# Altium project Senkron_Buck.PrjPcb (part 3 of 3)
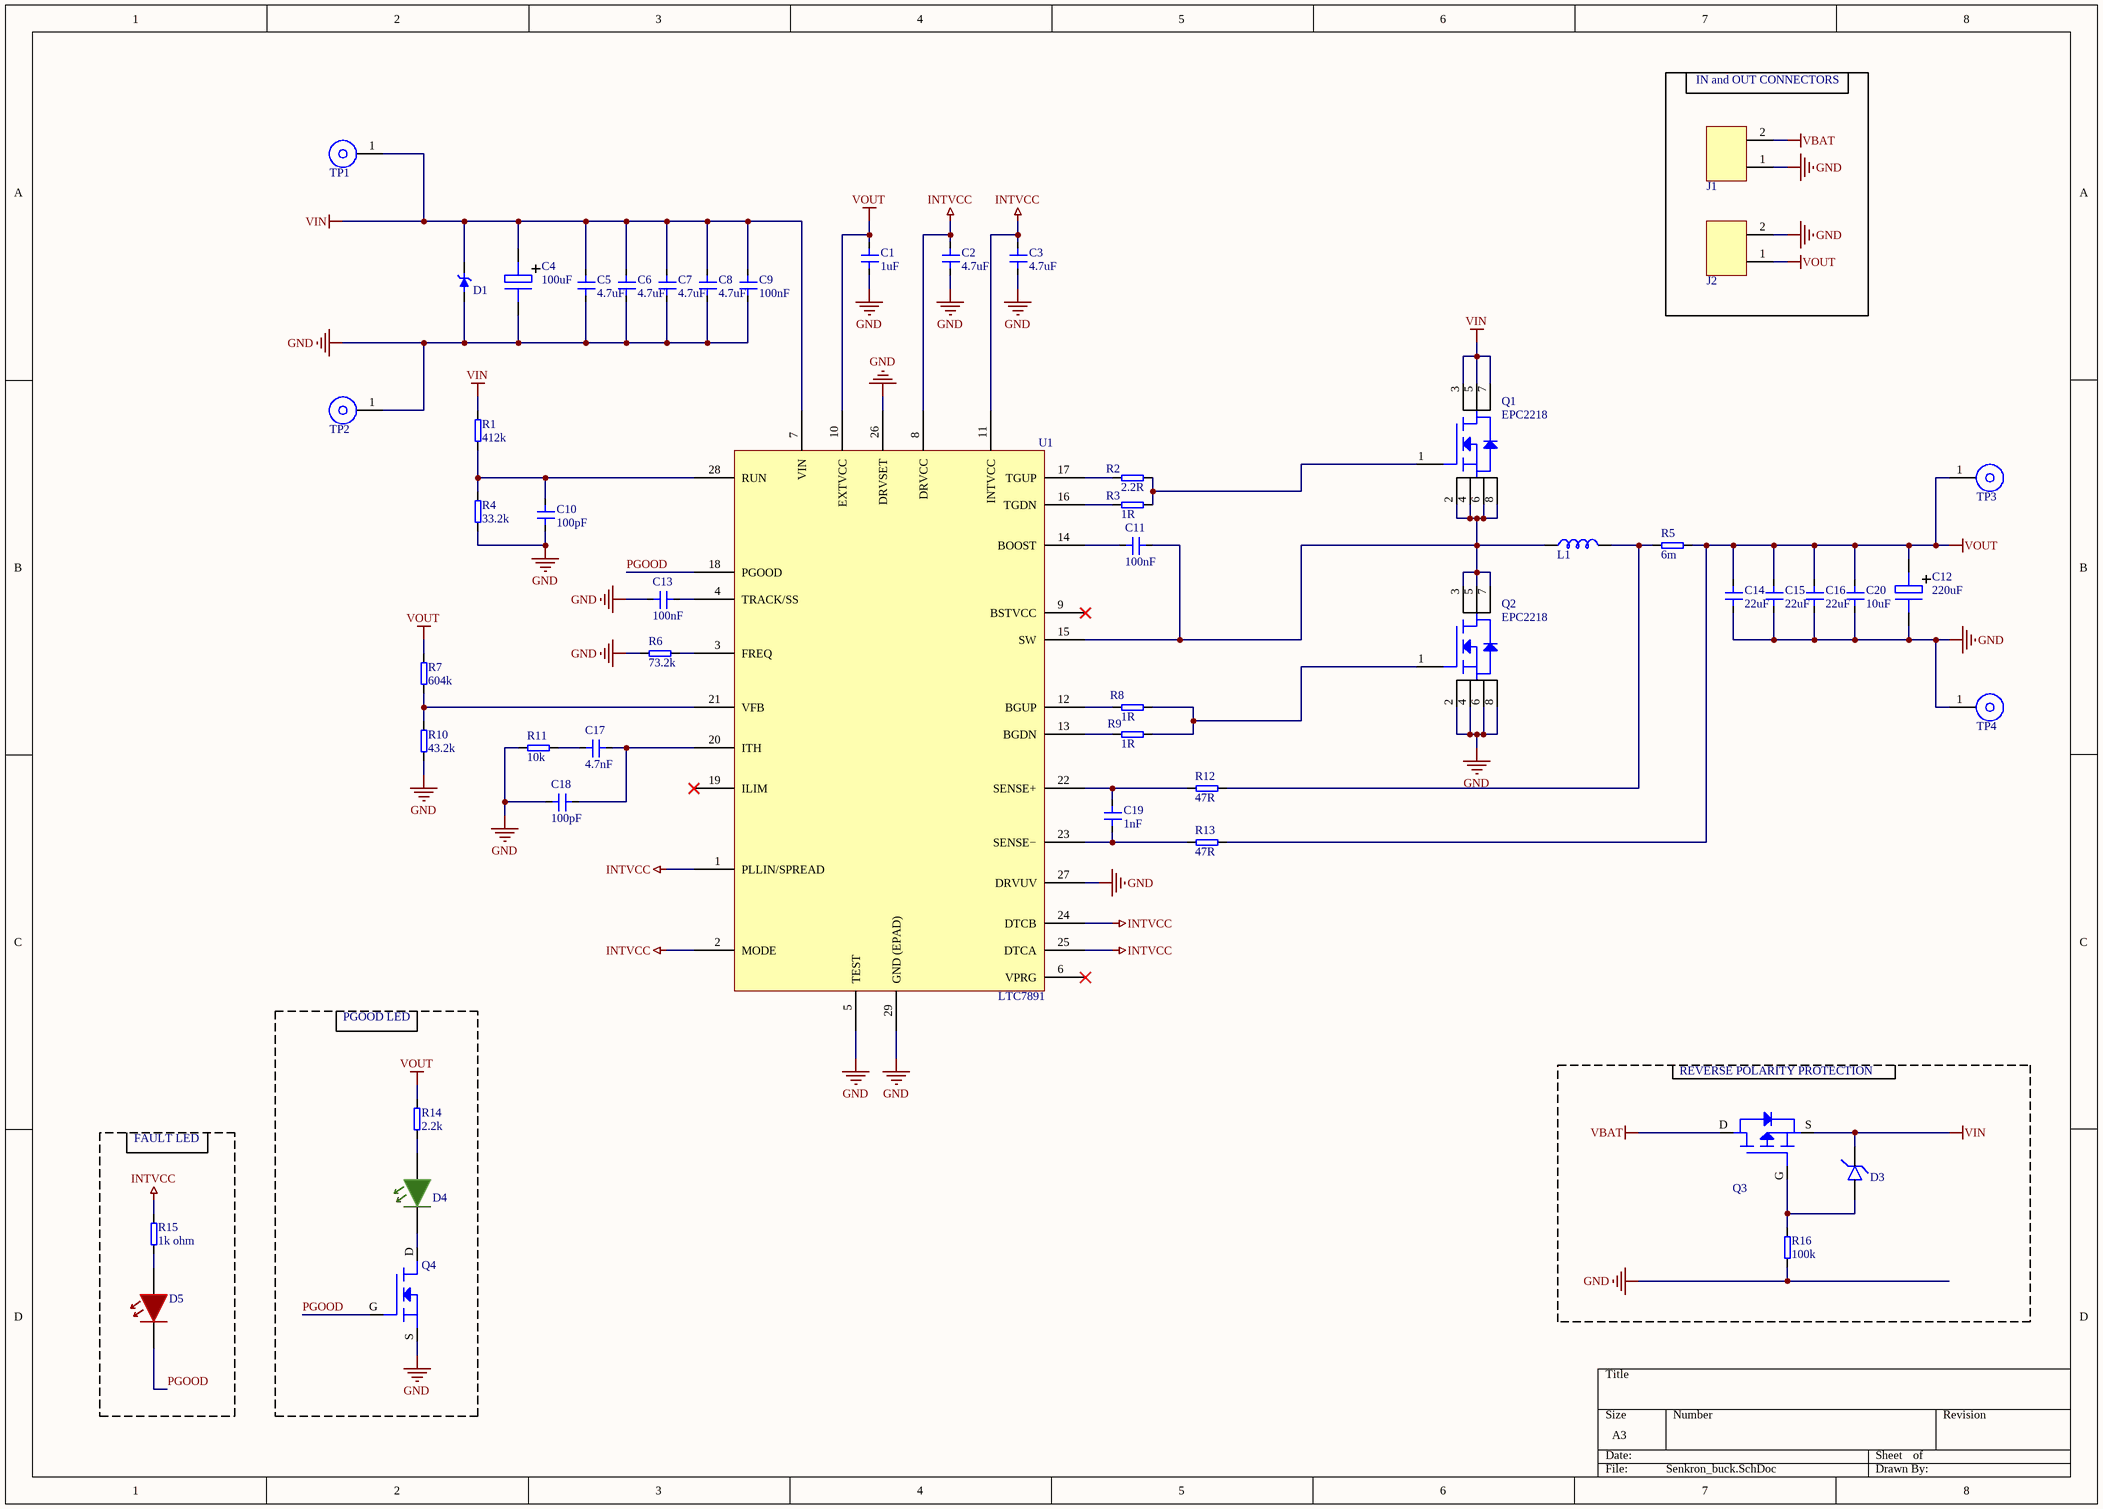
[diagram p2: Senkron_buck.SchDoc]

## Sheet Senkron_buck.SchDoc (continued)

### Library data of the parts (continued)
J1 J2 = 2P Screw Terminal Block: Barrier Strip Terminal Block, 13.5A, 1.5mm2, 1 Row(s), 1 Deck(s); Manufacturer: Phoenix Contact; Manufacturer Part Number: 1729128; Number of Decks: 1; Number of Ways: 2; Voltage Rating: 400V; Wire/Cable Gauge: 16AWG; Safety Approval: CSA,CUL,CB,EAC; ComponentLink1URL: https://datasheet.ciiva.com/16046/1729128-16046181.pdf?src-supplier=Onlinecomponents.com; ComponentLink1Description: https://datasheet.ciiva.com/16046/1729128-16046181.pdf?src-supplier=Onlinecomponents.com; ComponentLink2URL: https://datasheet.ciiva.com/15169/getdatasheetpartid-199310-15169845.pdf?src-supplier=Verical; ComponentLink2Description: https://datasheet.ciiva.com/15169/getdatasheetpartid-199310-15169845.pdf?src-supplier=Verical; ComponentLink3URL: https://datasheet.ciiva.com/823/1729128-823779.pdf?src-supplier=Digikey; ComponentLink3Description: https://datasheet.ciiva.com/823/1729128-823779.pdf?src-supplier=Digikey; ComponentLink4URL: https://datasheet.ciiva.com/14607/70054405-14607157.pdf?src-supplier=Allied+Electronics; ComponentLink4Description: https://datasheet.ciiva.com/14607/70054405-14607157.pdf?src-supplier=Allied+Electronics; ComponentLink5URL: https://datasheet.ciiva.com/29218/743664-da-01-en-printklemmenblock-mkdsn-1-5-2-5-08-29218154.pdf?src-supplier=Conrad; ComponentLink5Description: https://datasheet.ciiva.com/29218/743664-da-01-en-printklemmenblock-mkdsn-1-5-2-5-08-29218154.pdf?src-supplier=Conrad; ComponentLink6URL: https://datasheet.ciiva.com:443/pdfs/VipMasterIC/IC/ONST/ONST-S-A0002844216/ONST-S-A0002844216-1.pdf?src-supplier=IHS+Markit; ComponentLink6Description: https://datasheet.ciiva.com:443/pdfs/VipMasterIC/IC/ONST/ONST-S-A0002844216/ONST-S-A0002844216-1.pdf?src-supplier=IHS+Markit; ComponentLink7URL: https://datasheet.ciiva.com/825/osttcxx0162-825113.pdf?src-supplier=Digikey; ComponentLink7Description: https://datasheet.ciiva.com/825/osttcxx0162-825113.pdf?src-supplier=Digikey; ComponentLink8URL: https://datasheet.ciiva.com:443/pdfs/VipMasterIC/IC/PCON/PCON-S-A0008047989/PCON-S-A0008036843-1.pdf?src-supplier=IHS+Markit; ComponentLink8Description: https://datasheet.ciiva.com:443/pdfs/VipMasterIC/IC/PCON/PCON-S-A0008047989/PCON-S-A0008036843-1.pdf?src-supplier=IHS+Markit; Supplier: Digikey; Supplier Part Number: 277-1247-ND; RoHS: Yes; Category: Terminal Blocks; Stock: 25195; Pricing: 1=1,2, 10=1,104, 50=1,058, 100=1,012, 250=0,9844, 500=0,92, 1000=0,8464, 2500=0,782, 5000=0,7475 (USD); Mounting Technology: Board; Fastening Method: SCREW; Number of Rows: 1; Current Rating: 13.5A; Terminal and Terminal Block Type: BARRIER STRIP TERMINAL BLOCK; Wire Cross Section: 1.5mm2; RoHS Compliant: Yes; Reach SVHC Compliant: No
L1 = Inductor 10uH %20 SMD NONSTANDART 3.4mOhm: WE-HCI SMT Flat Wire High Current Inductor; Manufacturer: Wurth Elektronik; Manufacturer Part Number: 74435581000; DC Resistance (DCR): 3.4mΩ; Value: 10µH; Inductance Tolerance: 20%; Saturation Current: 8A; Self Resonant Frequency: 15MHz; ComponentLink1Description: Tedarikçi; ComponentLink1URL: https://www.e-komponent.com/10-uh-shielded-drum-core-wirewound-inductor-74435581000; Supplier: Mouser; Supplier Part Number: 710-74435581000; RoHS: Compliant; Category: Fixed Inductors; Stock: 497; Pricing: 1=7,34, 10=7,2, 50=6,37, 100=6,37, 1000=4,99, 10000=4,99 (USD); Ambient Temperature Range High: 75°C; Ambient Temperature Range Low: -40°C; Height: 12mm; Length: 22.5mm; Max Operating Temperature: 125°C; Min Operating Temperature: -40°C; Pins: 2; Width: 22mm; ComponentLink2URL: https://datasheet.octopart.com:443/74435581000-Wurth-Elektronik-datasheet-168489601.pdf?src-supplier=Wurth+Elektronik; ComponentLink2Description: https://datasheet.octopart.com:443/74435581000-Wurth-Elektronik-datasheet-168489601.pdf?src-supplier=Wurth+Elektronik; ComponentLink3URL: https://datasheet.octopart.com:443/74435581000-W%C3%BCrth-Elektronik-datasheet-141435431.pdf?src-supplier=Newark; ComponentLink3Description: https://datasheet.octopart.com:443/74435581000-W%C3%BCrth-Elektronik-datasheet-141435431.pdf?src-supplier=Newark; ComponentLink4URL: https://datasheet.octopart.com:443/74435581000-W%C3%BCrth-Elektronik-datasheet-12562517.pdf?src-supplier=Newark; ComponentLink4Description: https://datasheet.octopart.com:443/74435581000-W%C3%BCrth-Elektronik-datasheet-12562517.pdf?src-supplier=Newark; ComponentLink5URL: https://datasheet.octopart.com:443/74435581000-W%C3%BCrth-Elektronik-datasheet-112299786.pdf?src-supplier=Newark; ComponentLink5Description: https://datasheet.octopart.com:443/74435581000-W%C3%BCrth-Elektronik-datasheet-112299786.pdf?src-supplier=Newark
Q1 Q2 = EPC2218: N-Channel 100 V 60A (Ta) Surface Mount Die; Çalışma Sıcaklığı: -40°C ~ 150°C (TJ); Teknoloji: GaNFET (Gallium Nitride); Maksimum Açık Drain Source direnci - (Maks) @ Id, Vgs: 3.2mOhm @ 25A, 5V; Vgs(th) (Maks) @ Id: 2.5V @ 7mA; Maksimum Sürüş Gerilimi: 5V; Maksimum Gain Source Gerilimi: +6V, -4V; Drain Source Gerilimi (Vdss): 100 V; Maksimum Kapı Şarjı (Qg) @ Vgs: 16.3 nC @ 5 V; Maksimum Giriş Kapasitansı (Ciss) @ Vds: 2703 pF @ 50 V; Paket / Kılıf: Die; Montaj Tipi: Surface Mount; FET Tipi: N-Channel; Sürekli Drain Akımı (Id) @ 25°C: 60A (Ta); ComponentLink1Description: Tedarikçi; ComponentLink1URL: https://www.e-komponent.com/epc2218-epc-transistor-fet-mosfet-tekli; ComponentLink2Description: Datasheet; ComponentLink2URL: https://epc-co.com/epc/Portals/0/epc/documents/datasheets/EPC2218_datasheet.pdf?ver=C-R46UeqE-iEjg6gr7hUEg%3d%3d
Q3 = SQJ459EP-T1_GE3: SQJ459EP Series -60 V 0.024 Ohm Automotive P-Channel Mosfet - PowerPAK SO-8L; Manufacturer: Vishay; Continuous Drain Current (ID): 52A; Drain to Source Breakdown Voltage: -60V; Drain to Source Resistance: 18mΩ; Gate to Source Voltage (Vgs): 20V; Max Junction Temperature (Tj): 175°C; Number of Channels: 1; Power Dissipation: 83W; Turn-Off Delay Time: 88ns; Turn-On Delay Time: 12ns; Supplier: Mouser; Supplier Part Number: 78-SQJ459EP-T1_GE3; Manufacturer Part Number: SQJ459EP-T1_GE3; RoHS: Compliant; Category: MOSFETs; Stock: 10269; Pricing: 1=1,67, 10=1,26, 50=1,26, 100=0,864, 1000=0,633, 10000=0,526 (USD); Drain to Source Voltage (Vdss): -60V; Height: 1.267mm; Lifecycle Status: Production; Max Operating Temperature: 175°C; Min Breakdown Voltage: 60V; Min Operating Temperature: -55°C; Number of Elements: 1; Number of Terminals: 4; Schedule B: 8541290080, 8541290080|8541290080|8541290080|8541290080|8541290080; ComponentLink1URL: https://datasheet.octopart.com:443/SQJ459EP-T1_GE3-Vishay-datasheet-181474805.pdf?src-supplier=IHS; ComponentLink1Description: https://datasheet.octopart.com:443/SQJ459EP-T1_GE3-Vishay-datasheet-181474805.pdf?src-supplier=IHS; ComponentLink2URL: https://datasheet.octopart.com:443/SQJ459EP-T1_GE3-Vishay-datasheet-138899039.pdf?src-supplier=Upverter; ComponentLink2Description: https://datasheet.octopart.com:443/SQJ459EP-T1_GE3-Vishay-datasheet-138899039.pdf?src-supplier=Upverter; ComponentLink3URL: https://datasheet.octopart.com:443/SQJ459EP-T1_GE3-Vishay-datasheet-137754848.pdf?src-supplier=Future+Electronics; ComponentLink3Description: https://datasheet.octopart.com:443/SQJ459EP-T1_GE3-Vishay-datasheet-137754848.pdf?src-supplier=Future+Electronics; ComponentLink4URL: http://sigma.octopart.com:80/rohs_statement/Vishay-company-15.pdf?src-supplier=Compliance+Statements; ComponentLink4Description: http://sigma.octopart.com:80/rohs_statement/Vishay-company-15.pdf?src-supplier=Compliance+Statements
Q4 = PJA3416AE_R1_00001: MOSFET DIS.6.5A 20V N-CH SOT23 SMT; Manufacturer: Pan Jit; Designed by: Eren/Mehmet; Supplier: Mouser; Supplier Part Number: 241-PJA3416AER100001; Manufacturer Part Number: PJA3416AE_R1_00001; RoHS: No; Category: MOSFETs; Stock: 7147; Pricing: 1=0,29, 10=0,195, 50=0,195, 100=0,101, 1000=0,101, 10000=0,062 (USD); ComponentLink1Description: Datasheet; ComponentLink1URL: https://cdn.ozdisan.com/ETicaret_Dosya/601491_131509.pdf; ComponentLink2Description: Supplier; ComponentLink2URL: https://ozdisan.com/guc-yari-iletkenleri/mosfetler/discrete-mosfetler/PJA3416AER100001/601492
R1 = RES 412k Ohm %1 SMD 0805: RES.(2012) 0805 412K Ohms 1% 1/8W-S 100PPM; Manufacturer: Royal Ohm; Manufacturer Part Number: 0805S8F4123T5E; Supplier: Mouser; Supplier Part Number: 303-0805S8F4123T5E; Category: Uncategorized; Pricing: 10000=0,001 (USD); ComponentLink1Description: Tedarikçi; ComponentLink1URL: https://www.ozdisan.com/p/smt-smd-ve-cip-direncler-194/royalohm-0805s8f4123t5e-505640
R2 = RES 2.2R Ohm %1 SMD 0603_1: RES.(1608) 0603 2.2 Ohms 1% 1/10W AUTOMOTIV; Manufacturer: Royal Ohm; Manufacturer Part Number: CQ03SAF220KT5E; Value: 2.2Ω; Supplier: Mouser; Supplier Part Number: 303-CQ03SAF220KT5E; Category: Uncategorized; Pricing: 10000=0,002 (USD); ComponentLink1Description: Tedarikçi; ComponentLink1URL: https://www.ozdisan.com/p/smt-smd-ve-cip-direncler-194/royalohm-cq03saf220kt5e-587939
R3 R8 R9 = RES 1R Ohm %1 SMD 0603: RES.(1608) 0603 1 Ohms 1% 1/10W AUTOMOTIV; Manufacturer: Royal Ohm; Manufacturer Part Number: CQ03SAF100KT5E; Value: 1Ω; Supplier: Mouser; Supplier Part Number: 303-CQ03SAF100KT5E; Category: Uncategorized; Pricing: 10000=0,002 (USD); ComponentLink1Description: Tedarikçi; ComponentLink1URL: https://www.ozdisan.com/p/smt-smd-ve-cip-direncler-194/royalohm-cq03saf100kt5e-587589
R4 = RES 33.2k Ohm %1 SMD 0805: RES.(2012) 0805 33.2K Ohms 1% 1/8W-S 100PPM; Manufacturer: Royal Ohm; Manufacturer Part Number: 0805S8F3322T5E; Value: 33.2kΩ; Temperature Coefficient: 100ppm/°C; Supplier: Mouser; Supplier Part Number: 303-0805S8F3322T5E; Category: Uncategorized; Pricing: 10000=0,001 (USD); ComponentLink1URL: https://datasheet.octopart.com:443/0805S8F3322T5E-Royal-Ohm-datasheet-165785611.pdf?src-supplier=TME; ComponentLink1Description: https://datasheet.octopart.com:443/0805S8F3322T5E-Royal-Ohm-datasheet-165785611.pdf?src-supplier=TME; ComponentLink2URL: https://datasheet.octopart.com:443/0805S8F3322T5E-Royal-Ohm-datasheet-157855877.pdf?src-supplier=TME; ComponentLink2Description: https://datasheet.octopart.com:443/0805S8F3322T5E-Royal-Ohm-datasheet-157855877.pdf?src-supplier=TME; ComponentLink3URL: https://datasheet.octopart.com:443/0805S8F3322T5E-Royal-Ohm-datasheet-62069544.pdf?src-supplier=TME; ComponentLink3Description: https://datasheet.octopart.com:443/0805S8F3322T5E-Royal-Ohm-datasheet-62069544.pdf?src-supplier=TME; ComponentLink4Description: Tedarikçi; ComponentLink4URL: https://www.ozdisan.com/p/smt-smd-ve-cip-direncler-194/royalohm-0805s8f3322t5e-505560
R5 = RES 6m Ohm %1 SMD 1206: RES.(3216) 1206 6m Ohms 1% 1W 50PPM; Üretici Ürün Kodu: ML061WF600NT5E; Kılıf / Kasa: 1206 (3216 Metric); Direnç Değeri: 6 m Ohms; ComponentLink1Description: Tedarikçi; ComponentLink1URL: https://www.ozdisan.com/p/smt-smd-ve-cip-direncler-194/royalohm-ml061wf600nt5e-740932; Tolerans: ±1 %; Güç: 1W
R6 = RES 73.2k Ohm %1 SMD 0603: RES.(1608) 0603 73.2K Ohms 1% 1/10W-S 100PPM; Manufacturer: Royal Ohm; Manufacturer Part Number: 0603SAF7322T5E; Supplier: Mouser; Supplier Part Number: 303-0603SAF7322T5E; Category: Uncategorized; Pricing: 10000=0,001 (USD); ComponentLink1Description: Tedarikçi; ComponentLink1URL: https://www.ozdisan.com/p/smt-smd-ve-cip-direncler-194/royalohm-0603saf7322t5e-505956
R7 = RES 604k Ohm %1 SMD 0805: RES.(2012) 0805 604K Ohms 1% 1/8W-S 100PPM; Manufacturer: Royal Ohm; Manufacturer Part Number: 0805S8F6043T5E; Supplier: Mouser; Supplier Part Number: 303-0805S8F6043T5E; Category: Uncategorized; Pricing: 10000=0,001 (USD); ComponentLink1Description: Tedarikçi; ComponentLink1URL: https://www.ozdisan.com/p/smt-smd-ve-cip-direncler-194/royalohm-0805s8f6043t5e-505655
R10 = RES 43.2k Ohm %1 SMD 0805: RES.(2012) 0805 43.2K Ohms 1% 1/8W-S 100PPM; Manufacturer: Royal Ohm; Manufacturer Part Number: 0805S8F4322T5E; Value: 43.2kΩ; Temperature Coefficient: 100ppm/°C; Supplier: Mouser; Supplier Part Number: 303-0805S8F4322T5E; Category: Uncategorized; Pricing: 10000=0,001 (USD); ComponentLink1URL: https://datasheet.octopart.com:443/0805S8F4322T5E-Royal-Ohm-datasheet-165785611.pdf?src-supplier=TME; ComponentLink1Description: https://datasheet.octopart.com:443/0805S8F4322T5E-Royal-Ohm-datasheet-165785611.pdf?src-supplier=TME; ComponentLink2URL: https://datasheet.octopart.com:443/0805S8F4322T5E-Royal-Ohm-datasheet-157855877.pdf?src-supplier=TME; ComponentLink2Description: https://datasheet.octopart.com:443/0805S8F4322T5E-Royal-Ohm-datasheet-157855877.pdf?src-supplier=TME; ComponentLink3URL: https://datasheet.octopart.com:443/0805S8F4322T5E-Royal-Ohm-datasheet-62069544.pdf?src-supplier=TME; ComponentLink3Description: https://datasheet.octopart.com:443/0805S8F4322T5E-Royal-Ohm-datasheet-62069544.pdf?src-supplier=TME; ComponentLink4Description: Tedarikçi; ComponentLink4URL: https://www.ozdisan.com/p/smt-smd-ve-cip-direncler-194/royalohm-0805s8f4322t5e-505567
R11 = RES 10kOhm %1 SMD 0603: 100mW Thick Film Resistors ±100ppm/℃ ±1% 10kΩ 0603 Chip Resistor - Surface Mount ROHS; Manufacturer: Yageo Group; Manufacturer Part Number: RC0603FR-0710KL; Temperature Coefficient: 100ppm/°C; Voltage Rating: 75V; Voltage Rating (DC): 50V; Supplier: Mouser; Supplier Part Number: 603-RC0603FR-0710KL; RoHS: Compliant; Category: Chip SMD Resistors; Stock: 6497070; Pricing: 1=0,1, 10=0,006, 50=0,006, 100=0,006, 1000=0,006, 10000=0,002 (USD); Case/Package: 0603; Case Code (Imperial): 0603; Case Code (Metric): 0603; China RoHS: Non-Compliant; Composition: Thick Film; Depth: 800µm; Height: 450µm; Lead Free: Lead Free; Lead Pitch: 300µm; Length: 1.6mm; Lifecycle Status: Production; Max Operating Temperature: 155°C; Military Standard: Not; Min Operating Temperature: -55°C; Mounting Technology: Surface Mount; Pins: 2; Number of Terminals: 2; Packaging: Tape & Reel; Power Dissipation: 100mW; Power Rating: 100mW; REACH SVHC: Yes; Value: 10kΩ; Schedule B: 8533210045, 8533210045|8533210045|8533210045|8533210045|8533210045|8533210045|8533210045|8533210045|8533210045|8533210045|8533210045|8533210045|8533210045|8533210045|8533210045|8533210045|8533210045|8533210045|8533210045|8533210045|8533210045|8533210045|8533210045|85; Termination: SMD/SMT; Tolerance: 1%; Weight: 2.012816mg; Width: 800µm; Working Voltage: 75V; ComponentLink1URL: https://datasheet.octopart.com:443/RC0603FR-0710KL-Yageo-datasheet-175887523.pdf?src-supplier=IHS; ComponentLink1Description: https://datasheet.octopart.com:443/RC0603FR-0710KL-Yageo-datasheet-175887523.pdf?src-supplier=IHS; ComponentLink2URL: https://datasheet.octopart.com:443/RC0603FR-0710KL-Yageo-datasheet-103092701.pdf?src-supplier=Upverter; ComponentLink2Description: https://datasheet.octopart.com:443/RC0603FR-0710KL-Yageo-datasheet-103092701.pdf?src-supplier=Upverter; ComponentLink3URL: https://datasheet.octopart.com:443/RC0603FR-0710KL-Yageo-datasheet-98239111.pdf?src-supplier=Upverter; ComponentLink3Description: https://datasheet.octopart.com:443/RC0603FR-0710KL-Yageo-datasheet-98239111.pdf?src-supplier=Upverter; ComponentLink4URL: https://datasheet.octopart.com:443/RC0603FR-0710KL-Yageo-datasheet-141265859.pdf?src-supplier=Upverter; ComponentLink4Description: https://datasheet.octopart.com:443/RC0603FR-0710KL-Yageo-datasheet-141265859.pdf?src-supplier=Upverter; ComponentLink5URL: https://sigma.octopart.com:443/138820526/technical_drawing/Yageo-RC0603FR-0710KL.pdf?src-supplier=Upverter; ComponentLink5Description: https://sigma.octopart.com:443/138820526/technical_drawing/Yageo-RC0603FR-0710KL.pdf?src-supplier=Upverter; ComponentLink6URL: https://datasheet.octopart.com:443/RC0603FR-0710KL-Yageo-datasheet-8328172.pdf?src-supplier=Farnell; ComponentLink6Description: https://datasheet.octopart.com:443/RC0603FR-0710KL-Yageo-datasheet-8328172.pdf?src-supplier=Farnell; ComponentLink7URL: https://datasheet.octopart.com:443/RC0603FR-0710KL-Yageo-datasheet-13691069.pdf?src-supplier=Farnell; ComponentLink7Description: https://datasheet.octopart.com:443/RC0603FR-0710KL-Yageo-datasheet-13691069.pdf?src-supplier=Farnell; ComponentLink8URL: https://datasheet.octopart.com:443/RC0603FR-0710KL-Yageo-datasheet-62067350.pdf?src-supplier=element14+APAC; ComponentLink8Description: https://datasheet.octopart.com:443/RC0603FR-0710KL-Yageo-datasheet-62067350.pdf?src-supplier=element14+APAC; ComponentLink9URL: https://datasheet.octopart.com:443/RC0603FR-0710KL-Yageo-datasheet-17842380.pdf?src-supplier=element14+APAC; ComponentLink9Description: https://datasheet.octopart.com:443/RC0603FR-0710KL-Yageo-datasheet-17842380.pdf?src-supplier=element14+APAC; ComponentLink10URL: https://datasheet.octopart.com:443/RC0603FR-0710KL-Yageo-datasheet-15599030.pdf?src-supplier=Future+Electronics; ComponentLink10Description: https://datasheet.octopart.com:443/RC0603FR-0710KL-Yageo-datasheet-15599030.pdf?src-supplier=Future+Electronics; ComponentLink11URL: https://datasheet.octopart.com:443/RC0603FR-0710KL-Yageo-datasheet-164759695.pdf?src-supplier=Future+Electronics; ComponentLink11Description: https://datasheet.octopart.com:443/RC0603FR-0710KL-Yageo-datasheet-164759695.pdf?src-supplier=Future+Electronics; ComponentLink12URL: https://datasheet.octopart.com:443/RC0603FR-0710KL-Yageo-datasheet-127823281.pdf?src-supplier=Future+Electronics; ComponentLink12Description: https://datasheet.octopart.com:443/RC0603FR-0710KL-Yageo-datasheet-127823281.pdf?src-supplier=Future+Electronics; ComponentLink13URL: https://datasheet.octopart.com:443/RC0603FR-0710KL-Yageo-datasheet-137700087.pdf?src-supplier=Future+Electronics; ComponentLink13Description: https://datasheet.octopart.com:443/RC0603FR-0710KL-Yageo-datasheet-137700087.pdf?src-supplier=Future+Electronics; ComponentLink14URL: https://datasheet.octopart.com:443/RC0603FR-0710KL-Yageo-datasheet-27584510.pdf?src-supplier=Future+Electronics; ComponentLink14Description: https://datasheet.octopart.com:443/RC0603FR-0710KL-Yageo-datasheet-27584510.pdf?src-supplier=Future+Electronics; ComponentLink15URL: https://datasheet.octopart.com:443/RC0603FR-0710KL-Yageo-datasheet-8324193.pdf?src-supplier=Future+Electronics; ComponentLink15Description: https://datasheet.octopart.com:443/RC0603FR-0710KL-Yageo-datasheet-8324193.pdf?src-supplier=Future+Electronics; ComponentLink16URL: https://datasheet.octopart.com:443/RC0603FR-0710KL-Yageo-datasheet-12596169.pdf?src-supplier=Newark; ComponentLink16Description: https://datasheet.octopart.com:443/RC0603FR-0710KL-Yageo-datasheet-12596169.pdf?src-supplier=Newark; ComponentLink17URL: https://datasheet.octopart.com:443/RC0603FR-0710KL-Yageo-datasheet-503470.pdf?src-supplier=Newark; ComponentLink17Description: https://datasheet.octopart.com:443/RC0603FR-0710KL-Yageo-datasheet-503470.pdf?src-supplier=Newark; ComponentLink18URL: https://datasheet.octopart.com:443/RC0603FR-0710KL-Yageo-datasheet-34211833.pdf?src-supplier=Newark; ComponentLink18Description: https://datasheet.octopart.com:443/RC0603FR-0710KL-Yageo-datasheet-34211833.pdf?src-supplier=Newark; ComponentLink19URL: https://datasheet.octopart.com:443/RC0603FR-0710KL-Yageo-datasheet-79472498.pdf?src-supplier=Megastar; ComponentLink19Description: https://datasheet.octopart.com:443/RC0603FR-0710KL-Yageo-datasheet-79472498.pdf?src-supplier=Megastar; ComponentLink20URL: https://datasheet.octopart.com/RC0603FR-0710KL-Yageo-datasheet-73766026.pdf; ComponentLink20Description: https://datasheet.octopart.com/RC0603FR-0710KL-Yageo-datasheet-73766026.pdf; ComponentLink21URL: https://datasheet.octopart.com:443/RC0603FR-0710KL-Yageo-datasheet-118562.pdf?src-supplier=DigiKey; ComponentLink21Description: https://datasheet.octopart.com:443/RC0603FR-0710KL-Yageo-datasheet-118562.pdf?src-supplier=DigiKey; ComponentLink22URL: http://sigma.octopart.com:80/rohs_statement/Yageo-company-2.pdf?src-supplier=Compliance+Statements; ComponentLink22Description: http://sigma.octopart.com:80/rohs_statement/Yageo-company-2.pdf?src-supplier=Compliance+Statements; ComponentLink23URL: http://sigma.octopart.com:80/conflict_mineral_statement/Yageo-company-3.pdf?src-supplier=Compliance+Statements; ComponentLink23Description: http://sigma.octopart.com:80/conflict_mineral_statement/Yageo-company-3.pdf?src-supplier=Compliance+Statements; ComponentLink24Description: Tedarikçi; ComponentLink24URL: https://www.ozdisan.com/p/smt-smd-ve-cip-direncler-194/yageo-rc0603fr-0710kl-379294
R12 R13 = RES 47R Ohm %1 SMD 0603: RES.(1608) 0603 47 Ohms 1% 1/10W AUTOMOTIV; Manufacturer: Royal Ohm; Manufacturer Part Number: CQ03SAF470JT5E; Value: 47Ω; Supplier: Mouser; Supplier Part Number: 303-CQ03SAF470JT5E; Category: Uncategorized; Pricing: 10000=0,001 (USD); ComponentLink1URL: https://datasheet.octopart.com:443/CQ03SAF470JT5E-Royal-Ohm-datasheet-159080023.pdf?src-supplier=TME; ComponentLink1Description: https://datasheet.octopart.com:443/CQ03SAF470JT5E-Royal-Ohm-datasheet-159080023.pdf?src-supplier=TME; ComponentLink2URL: https://datasheet.octopart.com:443/CQ03SAF470JT5E-Royal-Ohm-datasheet-140586692.pdf?src-supplier=TME; ComponentLink2Description: https://datasheet.octopart.com:443/CQ03SAF470JT5E-Royal-Ohm-datasheet-140586692.pdf?src-supplier=TME; ComponentLink3Description: Tedarikçi; ComponentLink3URL: https://www.ozdisan.com/p/smt-smd-ve-cip-direncler-194/royalohm-cq03saf470jt5e-587944
R14 = RES 2.2k Ohm %1 SMD 0603: Res Thick Film 0603 2.2K Ohm 1% 0.1W(1/10W) +/-100ppm/C Epoxy Pad SMD T/R; Manufacturer: Yageo Group; Manufacturer Part Number: RC0603FR-072K2L; Max Power Dissipation: 100mW; Value: 2.2kΩ; Temperature Coefficient: 100ppm/°C; Voltage Rating: 75V; Voltage Rating (DC): 50V; Supplier: Mouser; Supplier Part Number: 603-RC0603FR-072K2L; RoHS: Compliant; Category: Chip SMD Resistors; Stock: 1388232; Pricing: 1=0,1, 10=0,007, 50=0,007, 100=0,006, 1000=0,006, 10000=0,002 (USD); Case/Package: 0603; Case Code (Imperial): 0603; Case Code (Metric): 0603; China RoHS: Non-Compliant; Composition: Thick Film; Depth: 800µm; Features: Moisture Resistant; Height: 450µm; Lead Free: Lead Free; Length: 1.6mm; Lifecycle Status: Production; Max Operating Temperature: 155°C; Military Standard: Not; Min Operating Temperature: -55°C; Mounting Technology: Surface Mount; Pins: 2; Number of Terminals: 2; Number of Terminations: 2; Packaging: Tape & Reel; Power Dissipation: 100mW; Power Rating: 100mW; REACH SVHC: Yes; Schedule B: 8533210045, 8533210045|8533210045|8533210045|8533210045|8533210045|8533210045|8533210045|8533210045|8533210045|8533210045|8533210045|8533210045|8533210045|8533210045|8533210045, 8533210045|8533210045|8533210045|8533210045|8533210045|8533210045|8533210045|8533210045|8533210045|8533210045|8533210045|8533210045|8533210045|8533210045|8533210045|8533210045, 8533210045|8533210045|8533210045|8533210045|8533210045|8533210045|8533210045|8533210045|8533210045|8533210045|8533210045|8533210045|8533210045|8533210045|8533210045|8533210045|8533210045; Termination: SMD/SMT; Tolerance: 1%; Width: 800µm; Working Voltage: 75V; ComponentLink1URL: https://datasheet.octopart.com:443/RC0603FR-072K2L-Yageo-datasheet-175887523.pdf?src-supplier=IHS; ComponentLink1Description: https://datasheet.octopart.com:443/RC0603FR-072K2L-Yageo-datasheet-175887523.pdf?src-supplier=IHS; ComponentLink2URL: https://datasheet.octopart.com:443/RC0603FR-072K2L-Yageo-datasheet-103092701.pdf?src-supplier=Upverter; ComponentLink2Description: https://datasheet.octopart.com:443/RC0603FR-072K2L-Yageo-datasheet-103092701.pdf?src-supplier=Upverter; ComponentLink3URL: https://datasheet.octopart.com:443/RC0603FR-072K2L-Yageo-datasheet-8328172.pdf?src-supplier=Newark; ComponentLink3Description: https://datasheet.octopart.com:443/RC0603FR-072K2L-Yageo-datasheet-8328172.pdf?src-supplier=Newark; ComponentLink4URL: https://datasheet.octopart.com:443/RC0603FR-072K2L-Yageo-datasheet-12596169.pdf?src-supplier=Newark; ComponentLink4Description: https://datasheet.octopart.com:443/RC0603FR-072K2L-Yageo-datasheet-12596169.pdf?src-supplier=Newark; ComponentLink5URL: https://datasheet.octopart.com:443/RC0603FR-072K2L-Yageo-datasheet-13691069.pdf?src-supplier=Newark; ComponentLink5Description: https://datasheet.octopart.com:443/RC0603FR-072K2L-Yageo-datasheet-13691069.pdf?src-supplier=Newark; ComponentLink6URL: https://datasheet.octopart.com:443/RC0603FR-072K2L-Yageo-datasheet-34211833.pdf?src-supplier=element14+APAC; ComponentLink6Description: https://datasheet.octopart.com:443/RC0603FR-072K2L-Yageo-datasheet-34211833.pdf?src-supplier=element14+APAC; ComponentLink7URL: https://datasheet.octopart.com:443/RC0603FR-072K2L-Yageo-datasheet-62067350.pdf?src-supplier=element14+APAC; ComponentLink7Description: https://datasheet.octopart.com:443/RC0603FR-072K2L-Yageo-datasheet-62067350.pdf?src-supplier=element14+APAC; ComponentLink8URL: https://datasheet.octopart.com:443/RC0603FR-072K2L-Yageo-datasheet-17842380.pdf?src-supplier=element14+APAC; ComponentLink8Description: https://datasheet.octopart.com:443/RC0603FR-072K2L-Yageo-datasheet-17842380.pdf?src-supplier=element14+APAC; ComponentLink9URL: https://datasheet.octopart.com:443/RC0603FR-072K2L-Yageo-datasheet-21426514.pdf?src-supplier=element14+APAC; ComponentLink9Description: https://datasheet.octopart.com:443/RC0603FR-072K2L-Yageo-datasheet-21426514.pdf?src-supplier=element14+APAC; ComponentLink10URL: https://datasheet.octopart.com:443/RC0603FR-072K2L-Yageo-datasheet-164759695.pdf?src-supplier=Future+Electronics; ComponentLink10Description: https://datasheet.octopart.com:443/RC0603FR-072K2L-Yageo-datasheet-164759695.pdf?src-supplier=Future+Electronics; ComponentLink11URL: https://datasheet.octopart.com:443/RC0603FR-072K2L-Yageo-datasheet-137700087.pdf?src-supplier=Future+Electronics; ComponentLink11Description: https://datasheet.octopart.com:443/RC0603FR-072K2L-Yageo-datasheet-137700087.pdf?src-supplier=Future+Electronics; ComponentLink12URL: https://datasheet.octopart.com:443/RC0603FR-072K2L-Yageo-datasheet-27584510.pdf?src-supplier=Future+Electronics; ComponentLink12Description: https://datasheet.octopart.com:443/RC0603FR-072K2L-Yageo-datasheet-27584510.pdf?src-supplier=Future+Electronics; ComponentLink13URL: https://datasheet.octopart.com:443/RC0603FR-072K2L-Yageo-datasheet-15599030.pdf?src-supplier=Future+Electronics; ComponentLink13Description: https://datasheet.octopart.com:443/RC0603FR-072K2L-Yageo-datasheet-15599030.pdf?src-supplier=Future+Electronics; ComponentLink14URL: https://datasheet.octopart.com:443/RC0603FR-072K2L-Yageo-datasheet-8324193.pdf?src-supplier=Future+Electronics; ComponentLink14Description: https://datasheet.octopart.com:443/RC0603FR-072K2L-Yageo-datasheet-8324193.pdf?src-supplier=Future+Electronics; ComponentLink15URL: https://datasheet.octopart.com:443/RC0603FR-072K2L-Yageo-datasheet-79472498.pdf?src-supplier=Megastar; ComponentLink15Description: https://datasheet.octopart.com:443/RC0603FR-072K2L-Yageo-datasheet-79472498.pdf?src-supplier=Megastar; ComponentLink16URL: https://datasheet.octopart.com/RC0603FR-072K2L-Yageo-datasheet-73766026.pdf; ComponentLink16Description: https://datasheet.octopart.com/RC0603FR-072K2L-Yageo-datasheet-73766026.pdf; ComponentLink17URL: https://datasheet.octopart.com:443/RC0603FR-072K2L-Yageo-datasheet-118562.pdf?src-supplier=DigiKey; ComponentLink17Description: https://datasheet.octopart.com:443/RC0603FR-072K2L-Yageo-datasheet-118562.pdf?src-supplier=DigiKey; ComponentLink18URL: https://datasheet.octopart.com:443/RC0603FR-072K2L-Yageo-datasheet-499455.pdf?src-supplier=element14; ComponentLink18Description: https://datasheet.octopart.com:443/RC0603FR-072K2L-Yageo-datasheet-499455.pdf?src-supplier=element14; ComponentLink19URL: http://sigma.octopart.com:80/conflict_mineral_statement/Yageo-company-3.pdf?src-supplier=Compliance+Statements; ComponentLink19Description: http://sigma.octopart.com:80/conflict_mineral_statement/Yageo-company-3.pdf?src-supplier=Compliance+Statements; ComponentLink20URL: http://sigma.octopart.com:80/rohs_statement/Yageo-company-2.pdf?src-supplier=Compliance+Statements; ComponentLink20Description: http://sigma.octopart.com:80/rohs_statement/Yageo-company-2.pdf?src-supplier=Compliance+Statements
R15 = RES 1kOhm %5 SMD 0603: (RC0603JR-071KL) SMD Chip Resistor, 1 kOhm, ï¿½ 5%, 100 mW, 0603 [1608 Metric], Thick Film, General Purpose; Manufacturer: Yageo; Value: 1kR; Temperature Coefficient: 100ppm/°C; Voltage Rating (DC): 50V; Power Rating: 100mW; Body Length: 1.6mm; Designed by: Eren/Mehmet; Supplier: Mouser; Supplier Part Number: 603-RC0603JR-071KL; Manufacturer Part Number: RC0603JR-071KL; RoHS: Yes; Category: Chip SMD Resistors; Stock: 1707256; Pricing: 1=0,1, 10=0,01, 50=0,01, 100=0,006, 1000=0,005, 10000=0,002 (USD); Case/Package: 0603; Pins: 2; Contact Plating: Tin,Matte; Case Code (Imperial): 0603; Case Code (Metric): 1608; Min Operating Temperature: -55°C; Max Operating Temperature: 155°C; Tolerance: 5%; Resistor Type: Thick Film; Packaging: Tape and Reel; Package Quantity: 5000; Voltage Rating: 50V; Termination: SMD/SMT; Series: RC; Resistance Tolerance: 5%; Construction: Rectangular; Max Power Dissipation: 100mW; Number of Terminations: 2; Voltage Rating (AC): 50V; Length: 1.6mm; Width: 0.8mm; Height: 0.45mm; Depth: 0.8mm; Reach SVHC Compliant: No; Lead Free: 5697LeadFree; Military Standard: Not; RoHS Compliant: Yes; ComponentLink1Description: https://ozdisan.com/pasif-komponentler/direncler/smt-smd-ve-cip-direncler/RC0603JR-071KL/534826; ComponentLink1URL: https://ozdisan.com/pasif-komponentler/direncler/smt-smd-ve-cip-direncler/RC0603JR-071KL/534826
R16 = RES 100kOhm %5 SMD 0603: (RC0603JR-07100KL) SMD Chip Resistor, 100 kOhm, ï¿½ 5%, 100 mW, 0603 [1608 Metric], Thick Film, General Purpose; Manufacturer: Yageo; Value: 100kR; Temperature Coefficient: 100ppm/°C; Voltage Rating: 50V; Power Rating: 100mW; Designed by: Eren/Mehmet; Supplier: Mouser; Supplier Part Number: 603-RC0603JR-07100KL; Manufacturer Part Number: RC0603JR-07100KL; RoHS: Yes; Category: Chip SMD Resistors; Stock: 474748; Pricing: 1=0,11, 10=0,012, 50=0,012, 100=0,007, 1000=0,006, 10000=0,003 (USD); Case/Package: 0603; Pins: 2; Contact Plating: Tin,Matte; Case Code (Imperial): 0603; Case Code (Metric): 1608; Min Operating Temperature: -55°C; Max Operating Temperature: 155°C; Tolerance: 5%; Resistor Type: Thick Film; Packaging: Tape and Reel; Voltage Rating (DC): 50V; Termination: SMD/SMT; Features: Moisture Resistant; Series: RC; Max Power Dissipation: 100mW; Number of Terminations: 2; Resistance Tolerance: 5%; Voltage Rating (AC): 50V; Width: 0.8mm; Reach SVHC Compliant: No; Lead Free: Lead Free; RoHS Compliant: Yes; ComponentLink1URL: https://datasheet.ciiva.com/7983/443971-7983686.pdf?src-supplier=Element14; ComponentLink1Description: https://datasheet.ciiva.com/7983/443971-7983686.pdf?src-supplier=Element14; ComponentLink2URL: https://datasheet.ciiva.com/7746/443971-7746423.pdf?src-supplier=Element14; ComponentLink2Description: https://datasheet.ciiva.com/7746/443971-7746423.pdf?src-supplier=Element14; ComponentLink3URL: https://datasheet.ciiva.com/7746/443971-7746424.pdf?src-supplier=Element14; ComponentLink3Description: https://datasheet.ciiva.com/7746/443971-7746424.pdf?src-supplier=Element14; ComponentLink4URL: https://datasheet.ciiva.com/8887/pyu-rc0603-51-rohs-l-4-8887903.pdf?src-supplier=Avnet; ComponentLink4Description: https://datasheet.ciiva.com/8887/pyu-rc0603-51-rohs-l-4-8887903.pdf?src-supplier=Avnet; ComponentLink5Description: https://ozdisan.com/pasif-komponentler/direncler/smt-smd-ve-cip-direncler/RC0603JR-07100KL/497416; ComponentLink5URL: https://ozdisan.com/pasif-komponentler/direncler/smt-smd-ve-cip-direncler/RC0603JR-07100KL/497416; ComponentLink6Description: Tedarikçi; ComponentLink6URL: https://www.ozdisan.com/p/SMT-SMD-and-Chip-Resistors-194/yageo-rc0603jr-07100kl-497416?srsltid=AfmBOorkxe1J5LG9tzeIkCUFacfrAbR8J3UYSLnWwXJC08_67mC0uBNS
TP1-TP4 = Test Point THT: PC TEST POINT MINIATURE BLACK 2.54MMX4.60MM; Üretici Ürün Kodu: L-KLS8-TP5001; ComponentLink1Description: Tedarikçi; ComponentLink1URL: https://www.ozdisan.com/p/pc-test-pointler-ve-minyaturleri-817/kls-electronic-l-kls8-tp5001-600171
U1 = LTC7891: DC/DC Cntrlr Single-OUT Step Down 3000kHz 28-Pin QFN EP Tube; Manufacturer: Analog Devices; Manufacturer Part Number: LTC7891RUFDM#PBF; Manufacturer Lifecycle Status: PRODUCTION; Number of Outputs: 1; Supplier: Mouser; Supplier Part Number: 584-LTC7891RUFDM#PBF; RoHS: Compliant; Category: Integrated Circuits (ICs); Stock: 2676; Pricing: 1=7,68, 10=5,88, 50=5,48, 100=4,82, 1000=4,1, 10000=4,1 (USD); Lifecycle Status: Production; Pins: 28; ComponentLink1URL: https://octopart.com:443/opatz8j6/c1?t=snJM-oqN4i5KXPf6ZxMSfJVmx5b3prQWZ1YKz55cdHAOssj69pUbq11y53jpNXLgDVTeVKh_vwiLev8R1iru9bPJp5JOpg9ew8c0B_bF-2YS9pTF3lgdNCKLFOCgo8Jn88ITyMWCmfrsakpbqVU-I1ivKY6ErxFGVx1GYBHLSensFupXT_FEQbv8rA2HkJZsYVbMh4WIG1CiBe5uoJ2eYwlHtRwQ-G-jIMChA-Aes9CE4uijDouR14g7-RwL4TDZrL2pCbdODDuimWYBWXHKqWkdIqanOPgu0UqdY264VTFYN6dtggArAJFY&src-supplier=Analog+Devices; ComponentLink1Description: https://octopart.com:443/opatz8j6/c1?t=snJM-oqN4i5KXPf6ZxMSfJVmx5b3prQWZ1YKz55cdHAOssj69pUbq11y53jpNXLgDVTeVKh_vwiLev8R1iru9bPJp5JOpg9ew8c0B_bF-2YS9pTF3lgdNCKLFOCgo8Jn88ITyMWCmfrsakpbqVU-I1ivKY6ErxFGVx1GYBHLSensFupXT_FEQbv8rA2HkJZsYVbMh4WIG1CiBe5uoJ2eYwlHtRwQ-G-jIMChA-Aes9CE4uijDouR14g7-RwL4TDZrL2pCbdODDuimWYBWXHKqWkdIqanOPgu0UqdY264VTFYN6dtggArAJFY&src-supplier=Analog+Devices; ComponentLink2URL: http://sigma.octopart.com:80/conflict_mineral_statement/Analog-Devices-company-33.pdf?src-supplier=Compliance+Statements; ComponentLink2Description: http://sigma.octopart.com:80/conflict_mineral_statement/Analog-Devices-company-33.pdf?src-supplier=Compliance+Statements; ComponentLink3URL: https://octopart.com:443/opatz8j6/c1?t=32ejukEi-HqHMGLwiRUrzAhWInM7hLec0v3ZO_WhOusfdH2Ui30HbHPrJcj8IvmQ7-lmTl5cYuZ4wtlVXzDVOAsjS9GVlgbgkqQ7P_FRkKOFVSjhwX5JmXoixYW2PdtwNDxpFfSC9joKpYxz9bdg26IoAKrbBQqS80qjTXeR4e7Yh5rkoZML1v9jBX_dn3vNQhnPUKjdp5LTYfhfKnQeBuYeR3Vl4kDkg2hCSb_e8QlaRBQ1S8NnWgMOPzdZPMAPPDkY_VUKaJzOt8Np22GOFLMnycaTHELw0jLblQXPWjWEkvFlSDVgwzmJ&src-supplier=Compliance+Statements; ComponentLink3Description: https://octopart.com:443/opatz8j6/c1?t=32ejukEi-HqHMGLwiRUrzAhWInM7hLec0v3ZO_WhOusfdH2Ui30HbHPrJcj8IvmQ7-lmTl5cYuZ4wtlVXzDVOAsjS9GVlgbgkqQ7P_FRkKOFVSjhwX5JmXoixYW2PdtwNDxpFfSC9joKpYxz9bdg26IoAKrbBQqS80qjTXeR4e7Yh5rkoZML1v9jBX_dn3vNQhnPUKjdp5LTYfhfKnQeBuYeR3Vl4kDkg2hCSb_e8QlaRBQ1S8NnWgMOPzdZPMAPPDkY_VUKaJzOt8Np22GOFLMnycaTHELw0jLblQXPWjWEkvFlSDVgwzmJ&src-supplier=Compliance+Statements; ComponentLink4Description: Tedarikçi; ComponentLink4URL: https://www.digikey.com/en/products/detail/analog-devices-inc/LTC7891RUFDM-TRPBF/16187359